# Altium project extension_shield.PrjPcb
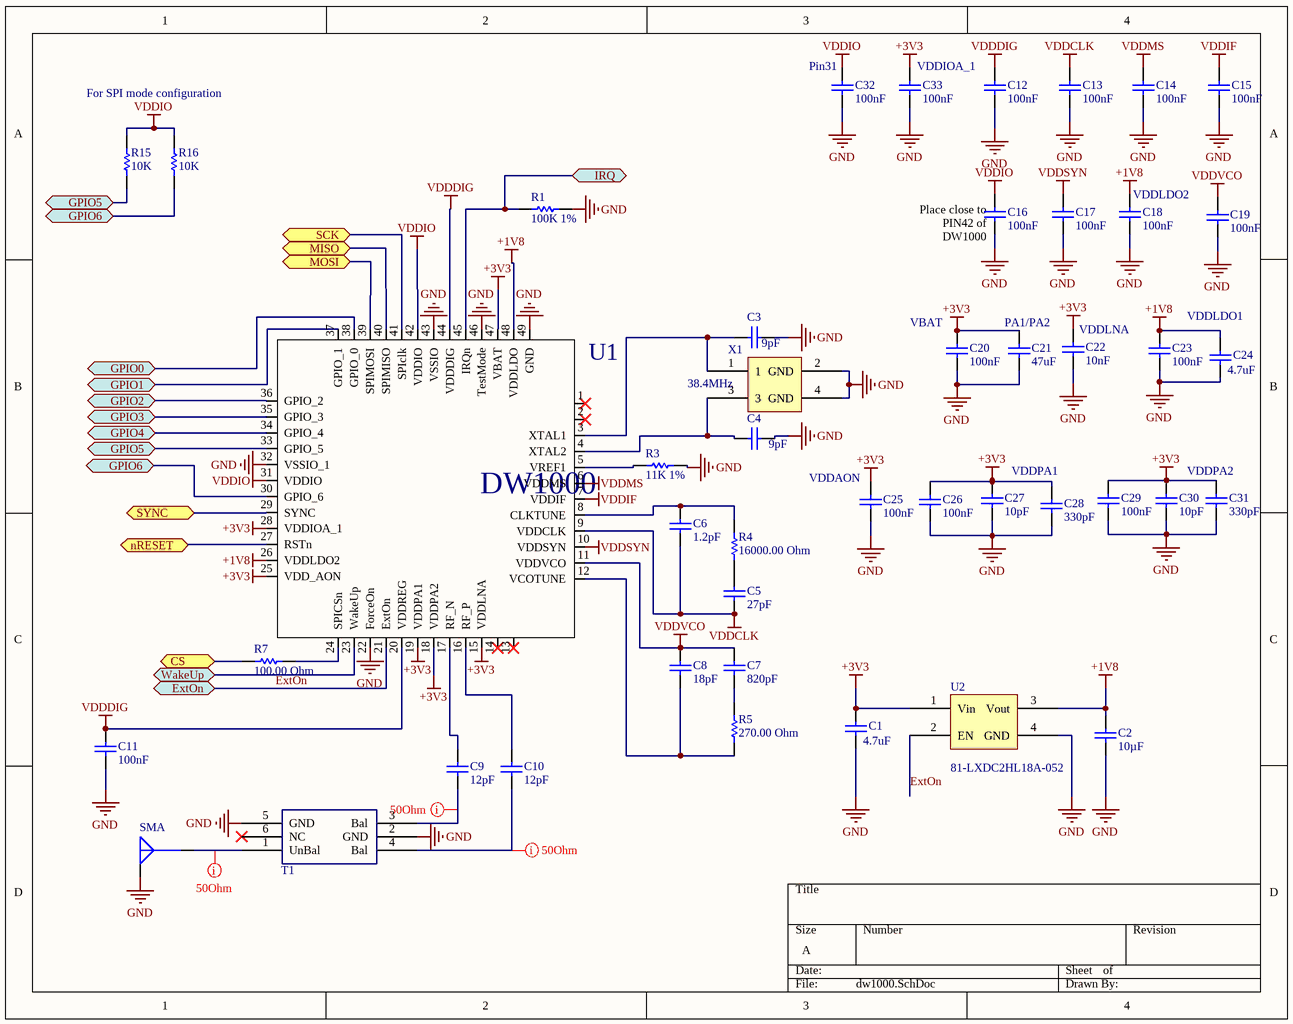
[diagram p0: dw1000.SchDoc]
2 sheets, 64 parts. Net scope: flat (ports and power ports of the same name join across sheets).
Board files: PCB1.PcbDoc, PCB2.PcbDoc
Sheets:
  dw1000.SchDoc
  pinheader.SchDoc

## Sheet dw1000.SchDoc
size A

### Parts
C1  4.7uF  [CAPC0603(1608)100_M]
C2  10µF  [CAPC1608X100X35ML20T25]
C3  9pF  [CAPC0402(1005)60_L]
C4  9pF  [CAPC0402(1005)60_L]
C5  27pF  [CAPC0402(1005)60_L]
C6  1.2pF  [CAPC0402(1005)60_L]
C7  820pF  [CAPC0402(1005)60_L]
C8  18pF  [CAPC0402(1005)60_L]
C9  12pF  [CAPC0402(1005)60_L]
C10  12pF  [CAPC0402(1005)60_L]
C11  100nF  [CAPC0402(1005)60_L]
C12  100nF  [CAPC0402(1005)60_L]
C13  100nF  [CAPC0402(1005)60_L]
C14  100nF  [CAPC0402(1005)60_L]
C15  100nF  [CAPC0402(1005)60_L]
C16  100nF  [CAPC0402(1005)60_L]
C17  100nF  [CAPC0402(1005)60_L]
C18  100nF  [CAPC0402(1005)60_L]
C19  100nF  [CAPC0402(1005)60_L]
C20  100nF  [CAPC0402(1005)60_L]
C21  47uF  [CAPC0805(2012)145_L]
C22  10nF  [CAPC0402(1005)60_L]
C23  100nF  [CAPC0402(1005)60_L]
C24  4.7uF  [CAPC0603(1608)100_M]
C25  100nF  [CAPC0402(1005)60_L]
C26  100nF  [CAPC0402(1005)60_L]
C27  10pF  [CAPC0402(1005)60_L]
C28  330pF  [CAPC0402(1005)60_L]
C29  100nF  [CAPC0402(1005)60_L]
C30  10pF  [CAPC0402(1005)60_L]
C31  330pF  [CAPC0402(1005)60_L]
C32  100nF  [CAPC0402(1005)60_L]
C33  100nF  [CAPC0402(1005)60_L]
R1  100K 1%  [RESC0402(1005)_M]
R3  11K 1%  [RESC0402(1005)_L]
R4  16000.00 Ohm  [RESC0402(1005)_L]
R5  270.00 Ohm  [RESC0402(1005)_L]
R7  100.00 Ohm  [RESC0402(1005)_L]
R15  10K  [RESC0603(1608)_L]
R16  10K  [RESC0603(1608)_L]
SMA  0732511150  [sma_footprint]  (value not drawn)
T1  HHM1595A1  [HHM1595A1]  (value not drawn)
U1  DW1000 IC  [QFN-48]  (value not drawn)
U2  81-LXDC2HL18A-052  [PCBComponent_1]
X1  38.4MHz  [tsx_3225fp]

### Ports
CS (bidir), ExtOn (bidir), GPIO0 (bidir), GPIO1 (bidir), GPIO2 (bidir), GPIO3 (bidir), GPIO4 (bidir), GPIO5 (bidir), GPIO6 (bidir), IRQ (bidir), MISO (bidir), MOSI (bidir), nRESET (bidir), SCK (bidir), SYNC (bidir), WakeUp (bidir)

### Nets
+1V8: C2.1 C18.1 C23.1 C24.2 U1.26(VDDLDO2) U1.48(VDDLDO) U2.3(Vout)
+3V3: C1.2 C20.1 C21.2 C22.1 C25.1 C26.1 C27.2 C28.1 C29.1 C30.2 C31.1 C33.1 U1.15(VDDLNA) U1.18(VDDPA2) U1.19(VDDPA1) U1.25(VDD_AON) U1.28(VDDIOA_1) U1.47(VBAT) U2.1(Vin)
GND: C1.1 C2.2 C3.2 C4.2 C11.2 C12.2 C13.2 C14.2 C15.2 C16.2 C17.2 C18.2 C19.2 C20.2 C21.1 C22.2 C23.2 C24.1 C25.2 C26.2 C27.1 C28.2 C29.2 C30.1 C31.2 C32.2 C33.2 R1.2 R3.2 SMA.G T1.2(GND) T1.5(GND) U1.22(ForceOn) U1.32(VSSIO_1) U1.43(VSSIO) U1.46(TestMode) U1.49(GND) U2.4(GND) X1.2(GND) X1.4(GND)
VDDCLK: C5.2 C6.2 C13.1 U1.9(VDDCLK)
VDDDIG: C11.1 C12.1 U1.20(VDDREG) U1.44(VDDDIG)
VDDIF: C15.1 U1.7(VDDIF)
VDDIO: C16.1 C32.1 R15.2 R16.2 U1.31(VDDIO) U1.42(VDDIO)
VDDMS: C14.1 U1.6(VDDMS)
VDDSYN: C17.1 U1.10(VDDSYN)
VDDVCO: C7.1 C8.2 C19.1 U1.11(VDDVCO)
ExtOn: U1.21(ExtOn) U2.2(EN) ; port ExtOn
NetC3_1: C3.1 U1.3(XTAL1) X1.1
NetC4_1: C4.1 U1.4(XTAL2) X1.3
NetC5_1: C5.1 R4.2
NetC6_1: C6.1 R4.1 U1.8(CLKTUNE)
NetC7_2: C7.2 R5.1
NetC8_1: C8.1 R5.2 U1.12(VCOTUNE)
NetC9_1: C9.1 U1.17(RF_N)
NetC9_2: C9.2 T1.3(Bal)
NetC10_1: C10.1 U1.16(RF_P)
NetC10_2: C10.2 T1.4(Bal)
NetCN5_1: U1.23(WakeUp) ; port WakeUp
NetCN5_2: R1.1 U1.45(IRQn) ; port IRQ
NetCN5_4: U1.39(SPIMOSI) ; port MOSI
NetCN5_5: U1.40(SPIMISO) ; port MISO
NetCN5_6: U1.41(SPIclk) ; port SCK
NetCN8_1: U1.27(RSTn) ; port nRESET
NetCN8_4: U1.29(SYNC) ; port SYNC
NetP2_2: R7.2 ; port CS
NetP3_1: U1.38(GPIO_0) ; port GPIO0
NetP3_3: U1.37(GPIO_1) ; port GPIO1
NetP3_5: U1.36(GPIO_2) ; port GPIO2
NetP3_7: U1.35(GPIO_3) ; port GPIO3
NetP3_9: U1.34(GPIO_4) ; port GPIO4
NetP3_11: R15.1 U1.33(GPIO_5) ; port GPIO5
NetP3_13: R16.1 U1.30(GPIO_6) ; port GPIO6
NetR3_1: R3.1 U1.5(VREF1)
NetR7_1: R7.1 U1.24(SPICSn)
NetSMA_S: SMA.S T1.1(UnBal)

Not connected (* = marked no-connect by the designer): T1 6(NC)*; U1 1* 2* 13* 14*

### Layout directives
rule Impedance Constraint [Min = 50.00    Max = 50.00    ]: NetC9_2, NetC10_2, NetSMA_S

### Notes on the sheet
- For SPI mode configuration
- (near C32) Pin31
- (near C33) VDDIOA_1
- (near C18) VDDLDO2
- (near C16) Place close to PIN42 of DW1000
- (near C20) VBAT
- (near C21) PA1/PA2
- (near C22) VDDLNA
- VDDLDO1
- (near C25) VDDAON
- VDDPA1
- VDDPA2
- (in symbol DW1000_QFN_48) DW1000

### Library data of the parts
C1 C24 = CMP-1035-02780-1: CAP 4.7uF 6.3V ±10% 0603 (1608 Metric) Thickness 1mm SMD; Case-Metric: 1608; Case-EIA: 0603; Tolerance: Â±10%; Technology: SMT; Value: 4.7uF; Max Thickness: 1 mm; Rated Voltage: 6.3 V
C2 = CMP-2000-05443-1: High Value Multilayer Ceramic Capacitor, 10 uF, +/- 20%, 10 V, -55 to 85 degC, 0603 (1608 Metric), RoHS, Tape and Reel; Manufacturer: Taiyo Yuden; Voltage - Rated: 10V; Catalog Drawings: xMKSeries_0603_0.8; Temperature Coefficient: X5R; Other Names: 587-2562-6; Featured Product: MultilayerChipCapacitors; Online Catalog: MSeries; Standard Package: 1; Capacitance: 10µF; Thickness (Max): 0.035"(0.90mm); Applications: GeneralPurpose; Manufacturer URL: http://www.t-yuden.com/; Datasheet Version: Apr-14; Mounting Type: SurfaceMount,MLCC; Height - Seated (Max): -; Tolerance: ±20%; Package Reference: 603; Ratings: -; Category: Capacitors; Lead Spacing: -; Package Description: 2-Pin Surface Mount Device, Body 1.70 x 0.90 mm; Packaging: Digi-Reel; Size / Dimension: 0.063"Lx0.031"W(1.60mmx0.80mm); Family: CeramicCapacitors; Datasheet URL: https://datasheet.ciiva.com/15921/288lmk107bbj106malt-15921300.pdf; Features: -; Series: M; Operating Temperature: -55degC~85degC; Lead Style: -; Package / Case: 0603(1608Metric)
C3 C4 = CMP-1034-00643-1: CAP 9pF 50V ±0.05pF 0402 (1005 Metric) Thickness 0.6mm SMD; Case-Metric: 1005; Case-EIA: 0402; Tolerance: Â±0.05pF; Technology: SMT; Max Thickness: 0.6 mm; Rated Voltage: 50 V; Value: 9pF
C5 = CMP-1034-00961-1: CAP 27pF 50V ±2% 0402 (1005 Metric) Thickness 0.6mm SMD; Tolerance: Â±2%; Case-EIA: 0402; Case-Metric: 1005; Value: 27pF; Technology: SMT; Rated Voltage: 50 V; Max Thickness: 0.6 mm
C6 = CMP-1034-00083-1: CAP 1.2pF 50V ±0.05pF 0402 (1005 Metric) Thickness 0.6mm SMD; Case-EIA: 0402; Tolerance: Â±0.05pF; Case-Metric: 1005; Value: 1.2pF; Rated Voltage: 50 V; Technology: SMT; Max Thickness: 0.6 mm
C7 = CMP-1034-01592-1: CAP 820pF 50V ±2% 0402 (1005 Metric) Thickness 0.6mm SMD; Case-Metric: 1005; Tolerance: Â±2%; Case-EIA: 0402; Value: 820pF; Max Thickness: 0.6 mm; Technology: SMT; Rated Voltage: 50 V
C8 = CMP-1034-00863-1: CAP 18pF 50V ±2% 0402 (1005 Metric) Thickness 0.6mm SMD; Case-Metric: 1005; Case-EIA: 0402; Tolerance: Â±2%; Technology: SMT; Max Thickness: 0.6 mm; Rated Voltage: 50 V; Value: 18pF
C9 C10 = CMP-1034-00768-1: CAP 12pF 50V ±2% 0402 (1005 Metric) Thickness 0.6mm SMD; Case-EIA: 0402; Case-Metric: 1005; Tolerance: Â±2%; Max Thickness: 0.6 mm; Technology: SMT; Rated Voltage: 50 V; Value: 12pF
C11-C20 C23 C25 C26 C29 C32 C33 = CMP-1034-02069-1: CAP 100nF 16V ±10% 0402 (1005 Metric) Thickness 0.6mm SMD; Case-EIA: 0402; Case-Metric: 1005; Tolerance: Â±10%; Value: 100nF; Max Thickness: 0.6 mm; Rated Voltage: 16 V; Technology: SMT
C21 = CMP-1036-04950-1: CAP 47uF 6.3V ±20% 0805 (2012 Metric) Thickness 1.45mm SMD; Case-EIA: 0805; Case-Metric: 2012; Tolerance: Â±20%; Technology: SMT; Value: 47uF; Max Thickness: 1.45 mm; Rated Voltage: 6.3 V
C22 = CMP-1034-01880-1: CAP 10nF 25V ±10% 0402 (1005 Metric) Thickness 0.6mm SMD; Tolerance: Â±10%; Case-Metric: 1005; Case-EIA: 0402; Technology: SMT; Value: 10nF; Max Thickness: 0.6 mm; Rated Voltage: 25 V
C27 C30 = CMP-1034-00722-1: CAP 10pF 50V ±2% 0402 (1005 Metric) Thickness 0.6mm SMD; Tolerance: Â±2%; Case-Metric: 1005; Case-EIA: 0402; Technology: SMT; Value: 10pF; Max Thickness: 0.6 mm; Rated Voltage: 50 V
C28 C31 = CMP-1034-01432-1: CAP 330pF 50V ±2% 0402 (1005 Metric) Thickness 0.6mm SMD; Tolerance: Â±2%; Case-EIA: 0402; Case-Metric: 1005; Value: 330pF; Technology: SMT; Rated Voltage: 50 V; Max Thickness: 0.6 mm
R1 = CMP-1011-00736-1: 100K 0.063W 1% 0402 (1005 Metric)  SMD; Value: 100000.00 Ohm; Case-EIA: 0402; Case-Metric: 1005; Power: 0.063 W; Tolerance: 1 %; Technology: SMT
R3 = CMP-1011-00627-1: 11K 0.063W 1% 0402 (1005 Metric)  SMD; Case-EIA: 0402; Case-Metric: 1005; Value: 11000.00 Ohm; Technology: SMT; Tolerance: 1 %; Power: 0.063 W
R4 = CMP-1011-00644-1: 16K 0.063W 1% 0402 (1005 Metric)  SMD; Case-EIA: 0402; Case-Metric: 1005; Power: 0.063 W; Value: 16000.00 Ohm; Technology: SMT; Tolerance: 1 %
R5 = CMP-1011-00444-1: 270R 0.063W 1% 0402 (1005 Metric)  SMD; Case-EIA: 0402; Case-Metric: 1005; Technology: SMT; Value: 270.00 Ohm; Tolerance: 1 %; Power: 0.063 W
R7 = CMP-1011-00397-1: 100R 0.063W 1% 0402 (1005 Metric)  SMD; Case-EIA: 0402; Case-Metric: 1005; Technology: SMT; Tolerance: 1 %; Power: 0.063 W; Value: 100.00 Ohm
R15 R16 = CMP-1012-00098-1: 10K 0.1W 5% 0603 (1608 Metric)  SMD; Case-EIA: 0603; Value: 10000.00 Ohm; Case-Metric: 1608; Technology: SMT; Tolerance: 5 %; Power: 0.1 W
SMA = 0732511150: CONN SMA JACK 50 OHM EDGE MNT; Manufacturer: Molex, LLC; Contact Termination: Solder; Impedance: 50 Ohm; Frequency - Max: 18GHz; Body Material: Brass; Body Finish: Gold; Center Contact Material: Beryllium Copper; Dielectric Material: Polytetrafluoroethylene (PTFE); Voltage Rating: 500V; Part Number: 0732511150; PartId: 21185; Supplier 1: Digi-Key; Supplier Part Number 1: WM5534-ND; ComponentLink1Description: Datasheet; ComponentLink1URL: http://www.molex.com/pdm_docs/sd/732511150_sd.pdf; ComponentLink2Description: Digi-Key Listing; ComponentLink2URL: http://www.digikey.ca/product-detail/en/molex-llc/0732511150/WM5534-ND/1465156; Price: 4.81; Type: Receptacle, Female Socket; Operating Temperature: -65C ~ 165C; Style: SMA; Series: 73251; Shield Termination: Solder; Mounting Type: Board Edge, End Launch; Cable Group: -; Fastening Type: Threaded; Features: -; Housing Colour: Gold; Ingress Protection: -; Center Contact Plating: Gold
T1 = HHM1595A1: HHM1595A1 3000MHz - 8000MHz 0805; Category Letter: T; Category: Filter; Part Number: HHM1595A1
U1 = DW1000_QFN_48: UWB DW1000; Manufacturer: Decawave Ltd.; Part Number: DW1000_QFN; Component Code: n/a; Component Type: Standard; Cost: *; Footprint: QFN_48; ComponentLink1Description: Datasheet Link
U2 X1 = Component_1
  U2: Supplier 1: Mouser; Supplier Part Number 1: 81-LXDC2HL18A-052

## Sheet pinheader.SchDoc
size A
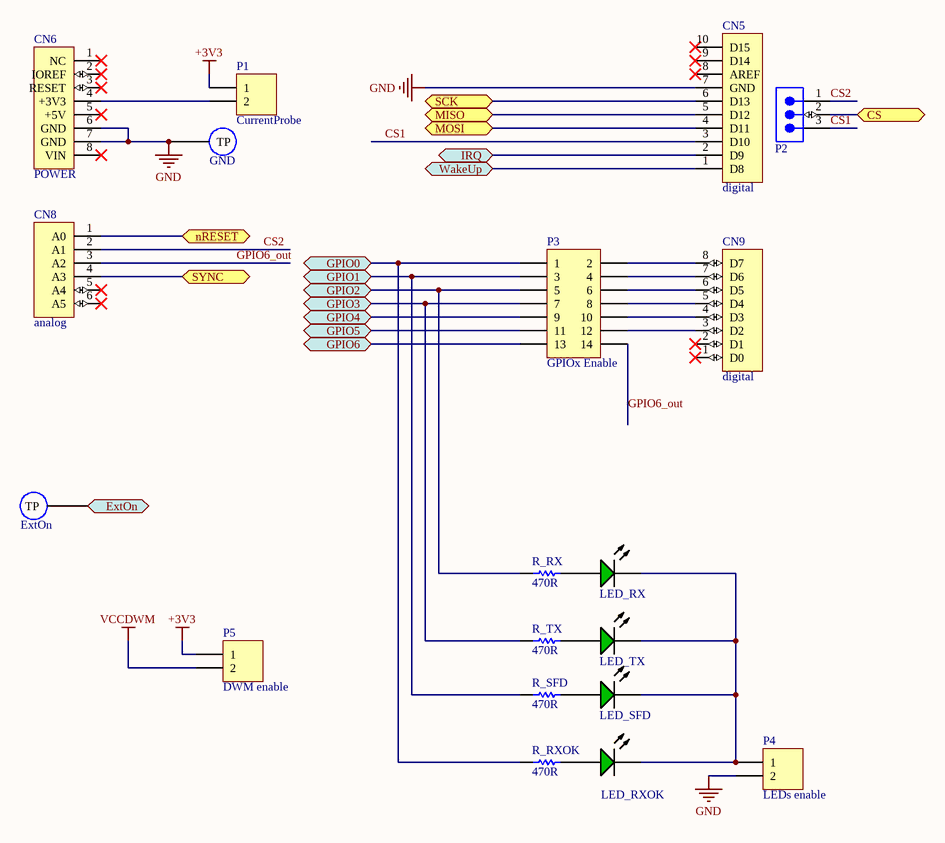
[diagram p1: pinheader.SchDoc]

### Parts
CN5  digital  [HDR1X10]
CN6  POWER  [HDR1X8]
CN8  analog  [HDR1X6]
CN9  digital  [HDR1X8]
ExtOn  Component_1  [KSTN-5000]  (value not drawn)
GND  Component_1  [KSTN-5000]  (value not drawn)
LED_RX  APG1608CGKC/T  [KING-LED0603-25-GREEN_V]  (value not drawn)
LED_RXOK  APG1608CGKC/T  [KING-LED0603-25-GREEN_V]  (value not drawn)
LED_SFD  APG1608CGKC/T  [KING-LED0603-25-GREEN_V]  (value not drawn)
LED_TX  APG1608CGKC/T  [KING-LED0603-25-GREEN_V]  (value not drawn)
P1  CurrentProbe  [HDR1X2H]
P2  Through-hole  [SMTC-MTSW-103-08-X-S-229-RA]  (value not drawn)
P3  GPIOx Enable  [HDR2X7]
P4  LEDs enable  [HDR1X2]
P5  DWM enable  [HDR1X2]
R_RX  470R  [RESC0603(1608)_L]
R_RXOK  470R  [RESC0603(1608)_L]
R_SFD  470R  [RESC0603(1608)_L]
R_TX  470R  [RESC0603(1608)_L]

### Ports
CS (bidir), ExtOn (bidir), GPIO0 (bidir), GPIO1 (bidir), GPIO2 (bidir), GPIO3 (bidir), GPIO4 (bidir), GPIO5 (bidir), GPIO6 (bidir), IRQ (bidir), MISO (bidir), MOSI (bidir), nRESET (bidir), SCK (bidir), SYNC (bidir), WakeUp (bidir)

### Nets
+3V3: P1.1 P5.1
GND: CN5.7(GND) CN6.6(GND) CN6.7(GND) GND.1(TP) P4.2
VCCDWM: P5.2
CS1: CN5.3(D10) P2.3
CS2: CN8.2(A1) P2.1
ExtOn: ExtOn.1(TP) ; port ExtOn
GPIO6_out: CN8.3(A2) P3.14
NetCN5_1: CN5.1(D8) ; port WakeUp
NetCN5_2: CN5.2(D9) ; port IRQ
NetCN5_4: CN5.4(D11) ; port MOSI
NetCN5_5: CN5.5(D12) ; port MISO
NetCN5_6: CN5.6(D13) ; port SCK
NetCN6_4: CN6.4(+3V3) P1.2
NetCN8_1: CN8.1(A0) ; port nRESET
NetCN8_4: CN8.4(A3) ; port SYNC
NetCN9_3: CN9.3(D2) P3.12
NetCN9_4: CN9.4(D3) P3.10
NetCN9_5: CN9.5(D4) P3.8
NetCN9_6: CN9.6(D5) P3.6
NetCN9_7: CN9.7(D6) P3.4
NetCN9_8: CN9.8(D7) P3.2
NetLED_RX_1: LED_RX.1(A) R_RX.2
NetLED_RX_2: LED_RX.2(K) LED_RXOK.2(K) LED_SFD.2(K) LED_TX.2(K) P4.1
NetLED_RXOK_1: LED_RXOK.1(A) R_RXOK.2
NetLED_SFD_1: LED_SFD.1(A) R_SFD.2
NetLED_TX_1: LED_TX.1(A) R_TX.2
NetP2_2: P2.2 ; port CS
NetP3_1: P3.1 R_RXOK.1 ; port GPIO0
NetP3_3: P3.3 R_SFD.1 ; port GPIO1
NetP3_5: P3.5 R_RX.1 ; port GPIO2
NetP3_7: P3.7 R_TX.1 ; port GPIO3
NetP3_9: P3.9 ; port GPIO4
NetP3_11: P3.11 ; port GPIO5
NetP3_13: P3.13 ; port GPIO6

Not connected (* = marked no-connect by the designer): CN5 8(AREF)* 9(D14)* 10(D15)*; CN6 1(NC)* 2(IOREF)* 3(RESET)* 5(+5V)* 8(VIN)*; CN8 5(A4)* 6(A5)*; CN9 1(D0)* 2(D1)*

### Library data of the parts
CN5 = Header 10: Header, 10-Pin; LatestRevisionDate: 17-Jul-2002; LatestRevisionNote: Re-released for DXP Platform.; Publisher: Altium Limited
CN6 CN9 = Header 8: Header, 8-Pin; LatestRevisionDate: 17-Jul-2002; LatestRevisionNote: Re-released for DXP Platform.; Publisher: Altium Limited
CN8 = Header 6: Header, 6-Pin; LatestRevisionDate: 17-Jul-2002; LatestRevisionNote: Re-released for DXP Platform.; Publisher: Altium Limited
ExtOn GND = Component_1: test point
LED_RX LED_RXOK LED_SFD LED_TX = CMP-0239-00001-1: LED, SMT, 0603(1608), 0.25mm Thickness, Green; Forward Current: 30 mA; Reverse Voltage: 5 V; Power Dissipation: 78 mW; Packing: Reel; ComponentLink1Description: Manufacturer URL; ComponentLink1URL: http://www.kingbrightusa.com/; ComponentLink2URL: http://www.kingbrightusa.com/images/catalog/SPEC/APG1608CGKC-T.pdf; Mounting Technology: Surface Mount; Storage Temperature: -40 to 85 degC; DatasheetVersion: Rev. 5B, 10/2012; PartNumber: APG1608CGKC/T; PackageReference: LED0603-25-GREEN; ComponentLink2Description: Datasheet; PackageDescription: 2-Pin SMT LED, 1.6 x 0.8 mm Body, 0.25mm Thickness; PackageVersion: Rev. 5B, 10/2012
P1 = Header 2H: Header, 2-Pin, Right Angle; LatestRevisionDate: 17-Jul-2002; LatestRevisionNote: Re-released for DXP Platform.; Publisher: Altium Limited
P2 = CMP-1024-00100-1: Modified .025" SQ Post Header, Through-hole, Right Angle, -55 to 125 degC, 2.54 mm Pitch, 3-Pin, Male, RoHS; Manufacturer: Samtec; PartNumber: MTSW-103-08-G-S-229-RA; Pitch: 2.54 mm; ComponentLink1URL: http://www.samtec.com; ComponentLink3Description: Package Specification; Mounting Technology: Through-hole; PackageDescription: Assembly .025" [.64] SQ Post Terminal Strip; ComponentLink2URL: http://www.samtec.com/documents/webfiles/pdf/MTSW.PDF; PackageVersion: BI, 2/1987; ComponentLink1Description: Manufacturer URL; PackageReference: MTSW-103-08-X-S-229-RA; Orientation: Right Angle; DatasheetVersion: F-214; RoHS: True; Temperature Range: -55 to 125 degC; ComponentLink3URL: http://www.samtec.com/documents/webfiles/cpdf/MTSW-XXX-XX-X-X-XXXX-XX-XXX-MKT1.pdf; ComponentLink2Description: Datasheet
P3 = Header 7X2: Header, 7-Pin, Dual row; LatestRevisionDate: 17-Jul-2002; LatestRevisionNote: Re-released for DXP Platform.; Publisher: Altium Limited
P4 P5 = Header 2: Header, 2-Pin; LatestRevisionDate: 17-Jul-2002; LatestRevisionNote: Re-released for DXP Platform.; Publisher: Altium Limited
R_RX R_RXOK R_SFD R_TX = CMP-1012-00473-1: 470R 0.1W 1% 0603 (1608 Metric)  SMD; Value: 470.00 Ohm; Case-Metric: 1608; Case-EIA: 0603; Power: 0.1 W; Technology: SMT; Tolerance: 1 %

## Nets that join several sheets
+3V3: dw1000 (19 pins), pinheader (P1.1 P5.1)
GND: dw1000 (40 pins), pinheader (5 pins)
ExtOn: dw1000 (U1.21 U2.2), pinheader (ExtOn.1)
NetCN5_1: dw1000 (U1.23), pinheader (CN5.1)
NetCN5_2: dw1000 (R1.1 U1.45), pinheader (CN5.2)
NetCN5_4: dw1000 (U1.39), pinheader (CN5.4)
NetCN5_5: dw1000 (U1.40), pinheader (CN5.5)
NetCN5_6: dw1000 (U1.41), pinheader (CN5.6)
NetCN8_1: dw1000 (U1.27), pinheader (CN8.1)
NetCN8_4: dw1000 (U1.29), pinheader (CN8.4)
NetP2_2: dw1000 (R7.2), pinheader (P2.2)
NetP3_1: dw1000 (U1.38), pinheader (P3.1 R_RXOK.1)
NetP3_3: dw1000 (U1.37), pinheader (P3.3 R_SFD.1)
NetP3_5: dw1000 (U1.36), pinheader (P3.5 R_RX.1)
NetP3_7: dw1000 (U1.35), pinheader (P3.7 R_TX.1)
NetP3_9: dw1000 (U1.34), pinheader (P3.9)
NetP3_11: dw1000 (R15.1 U1.33), pinheader (P3.11)
NetP3_13: dw1000 (R16.1 U1.30), pinheader (P3.13)